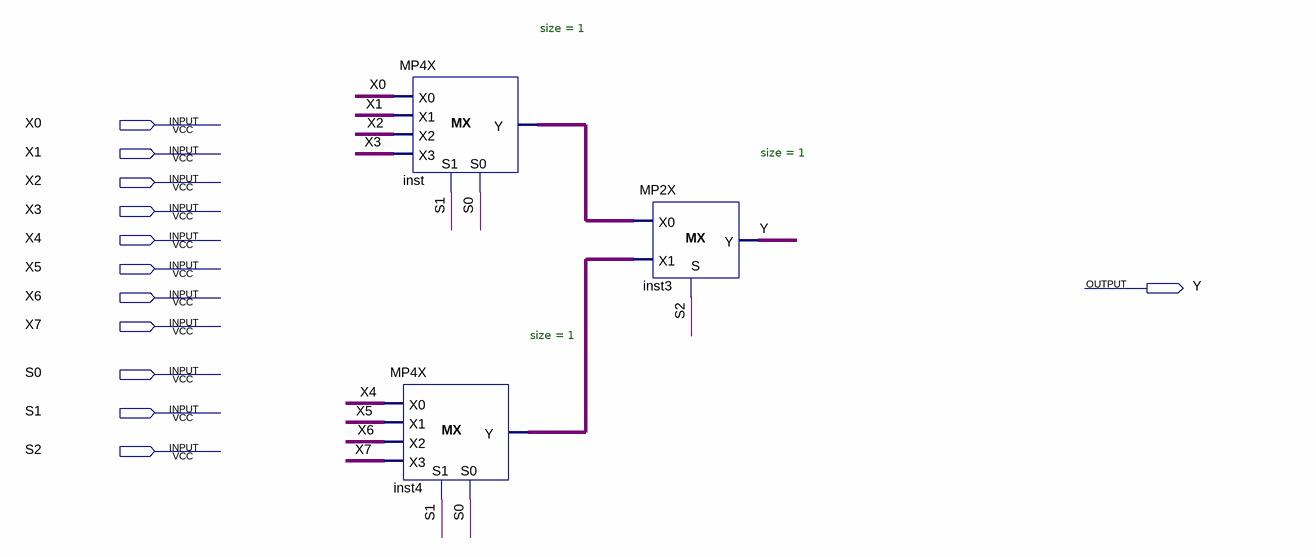
[diagram p0: schematic sheet]
// Quartus schematic MP8_1b.bdf as structural Verilog: 3 symbols, 12 pins
module MP8_1b (
  input  X0,
  input  X1,
  input  X2,
  input  X3,
  input  X4,
  input  X5,
  input  X6,
  input  X7,
  input  S0,
  input  S1,
  input  S2,
  output Y
);

  wire inst4_y, inst_y;

  MP4X #(.size(1)) inst4 (.S0(S0), .S1(S1), .X0(X4), .X1(X5), .X2(X6), .X3(X7), .Y(inst4_y));
  MP4X #(.size(1)) inst (.S0(S0), .S1(S1), .X0(X0), .X1(X1), .X2(X2), .X3(X3), .Y(inst_y));
  MP2X #(.size(1)) inst3 (.S(S2), .X0(inst_y), .X1(inst4_y), .Y(Y));
endmodule
